# EasyEDA schematic SCH_fpga扩展板v1_2023-12-09.json

## Sheets
1 Sheet_in: TITLE: Sheet_1; REV: 1.0; Date: 2023-11-29; Sheet: 1/1; Company: Your Company
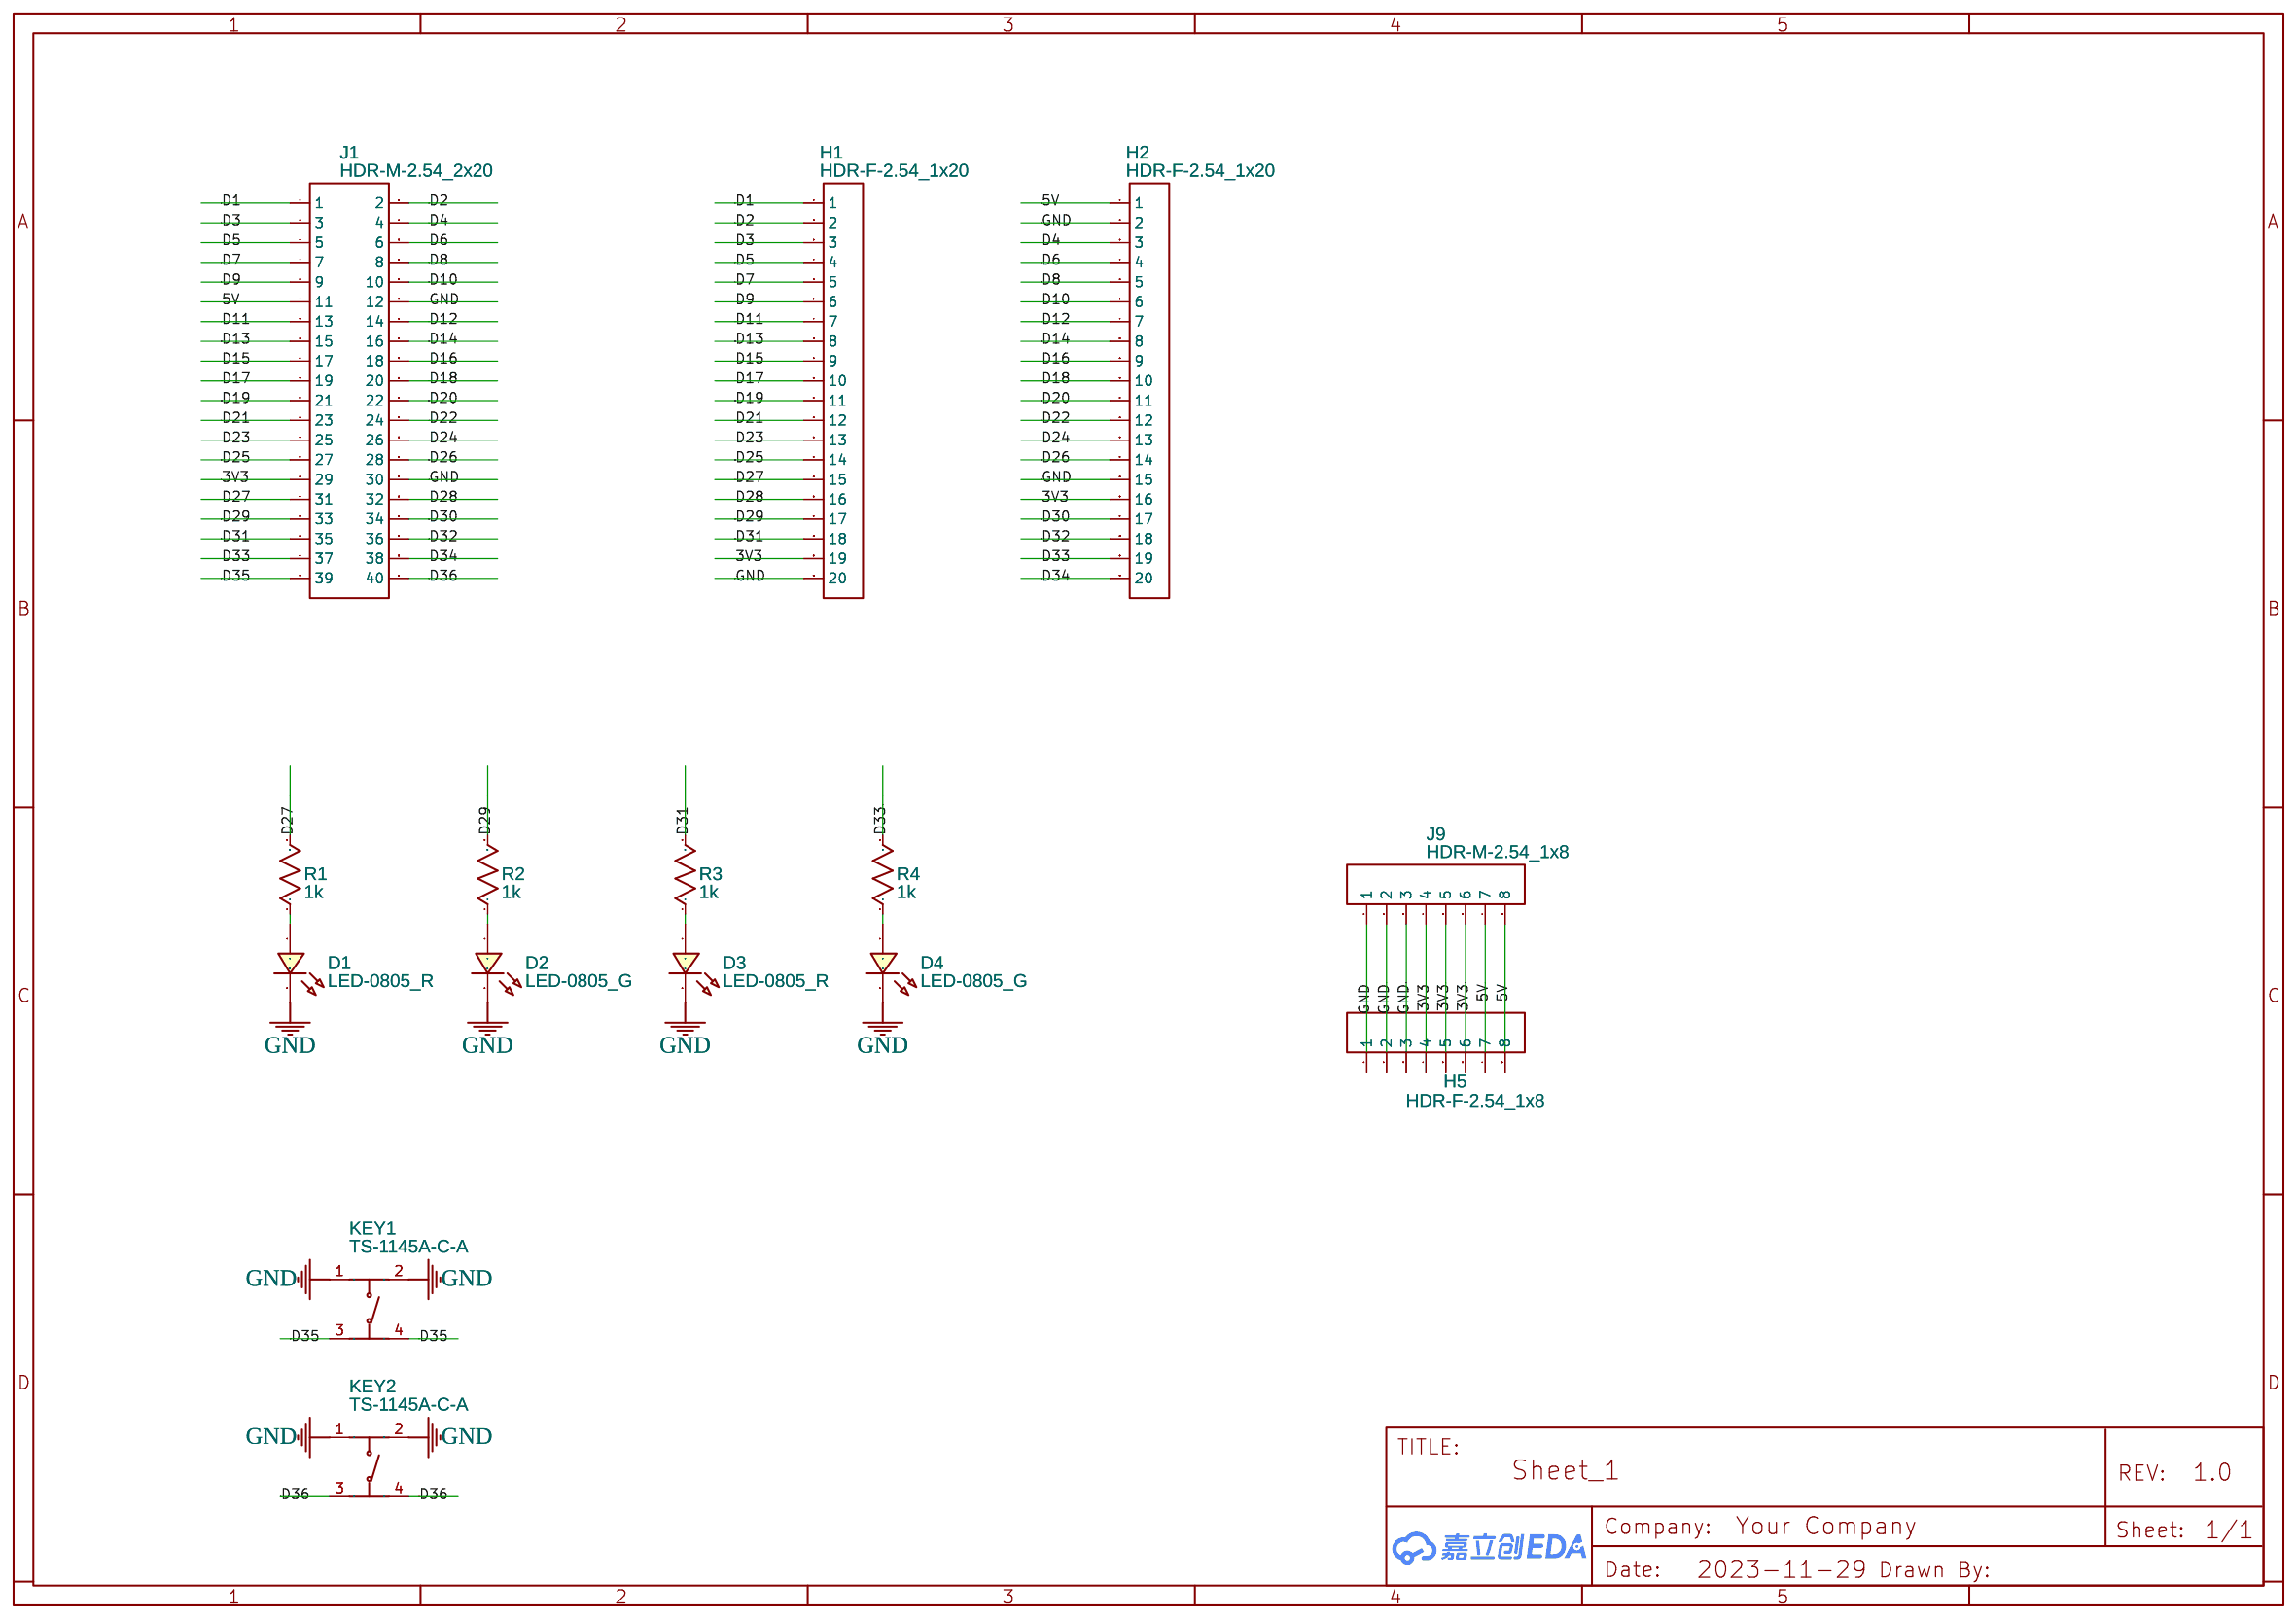
[diagram p0: Sheet_in]
2 Sheet_ctrl: TITLE: Sheet_2
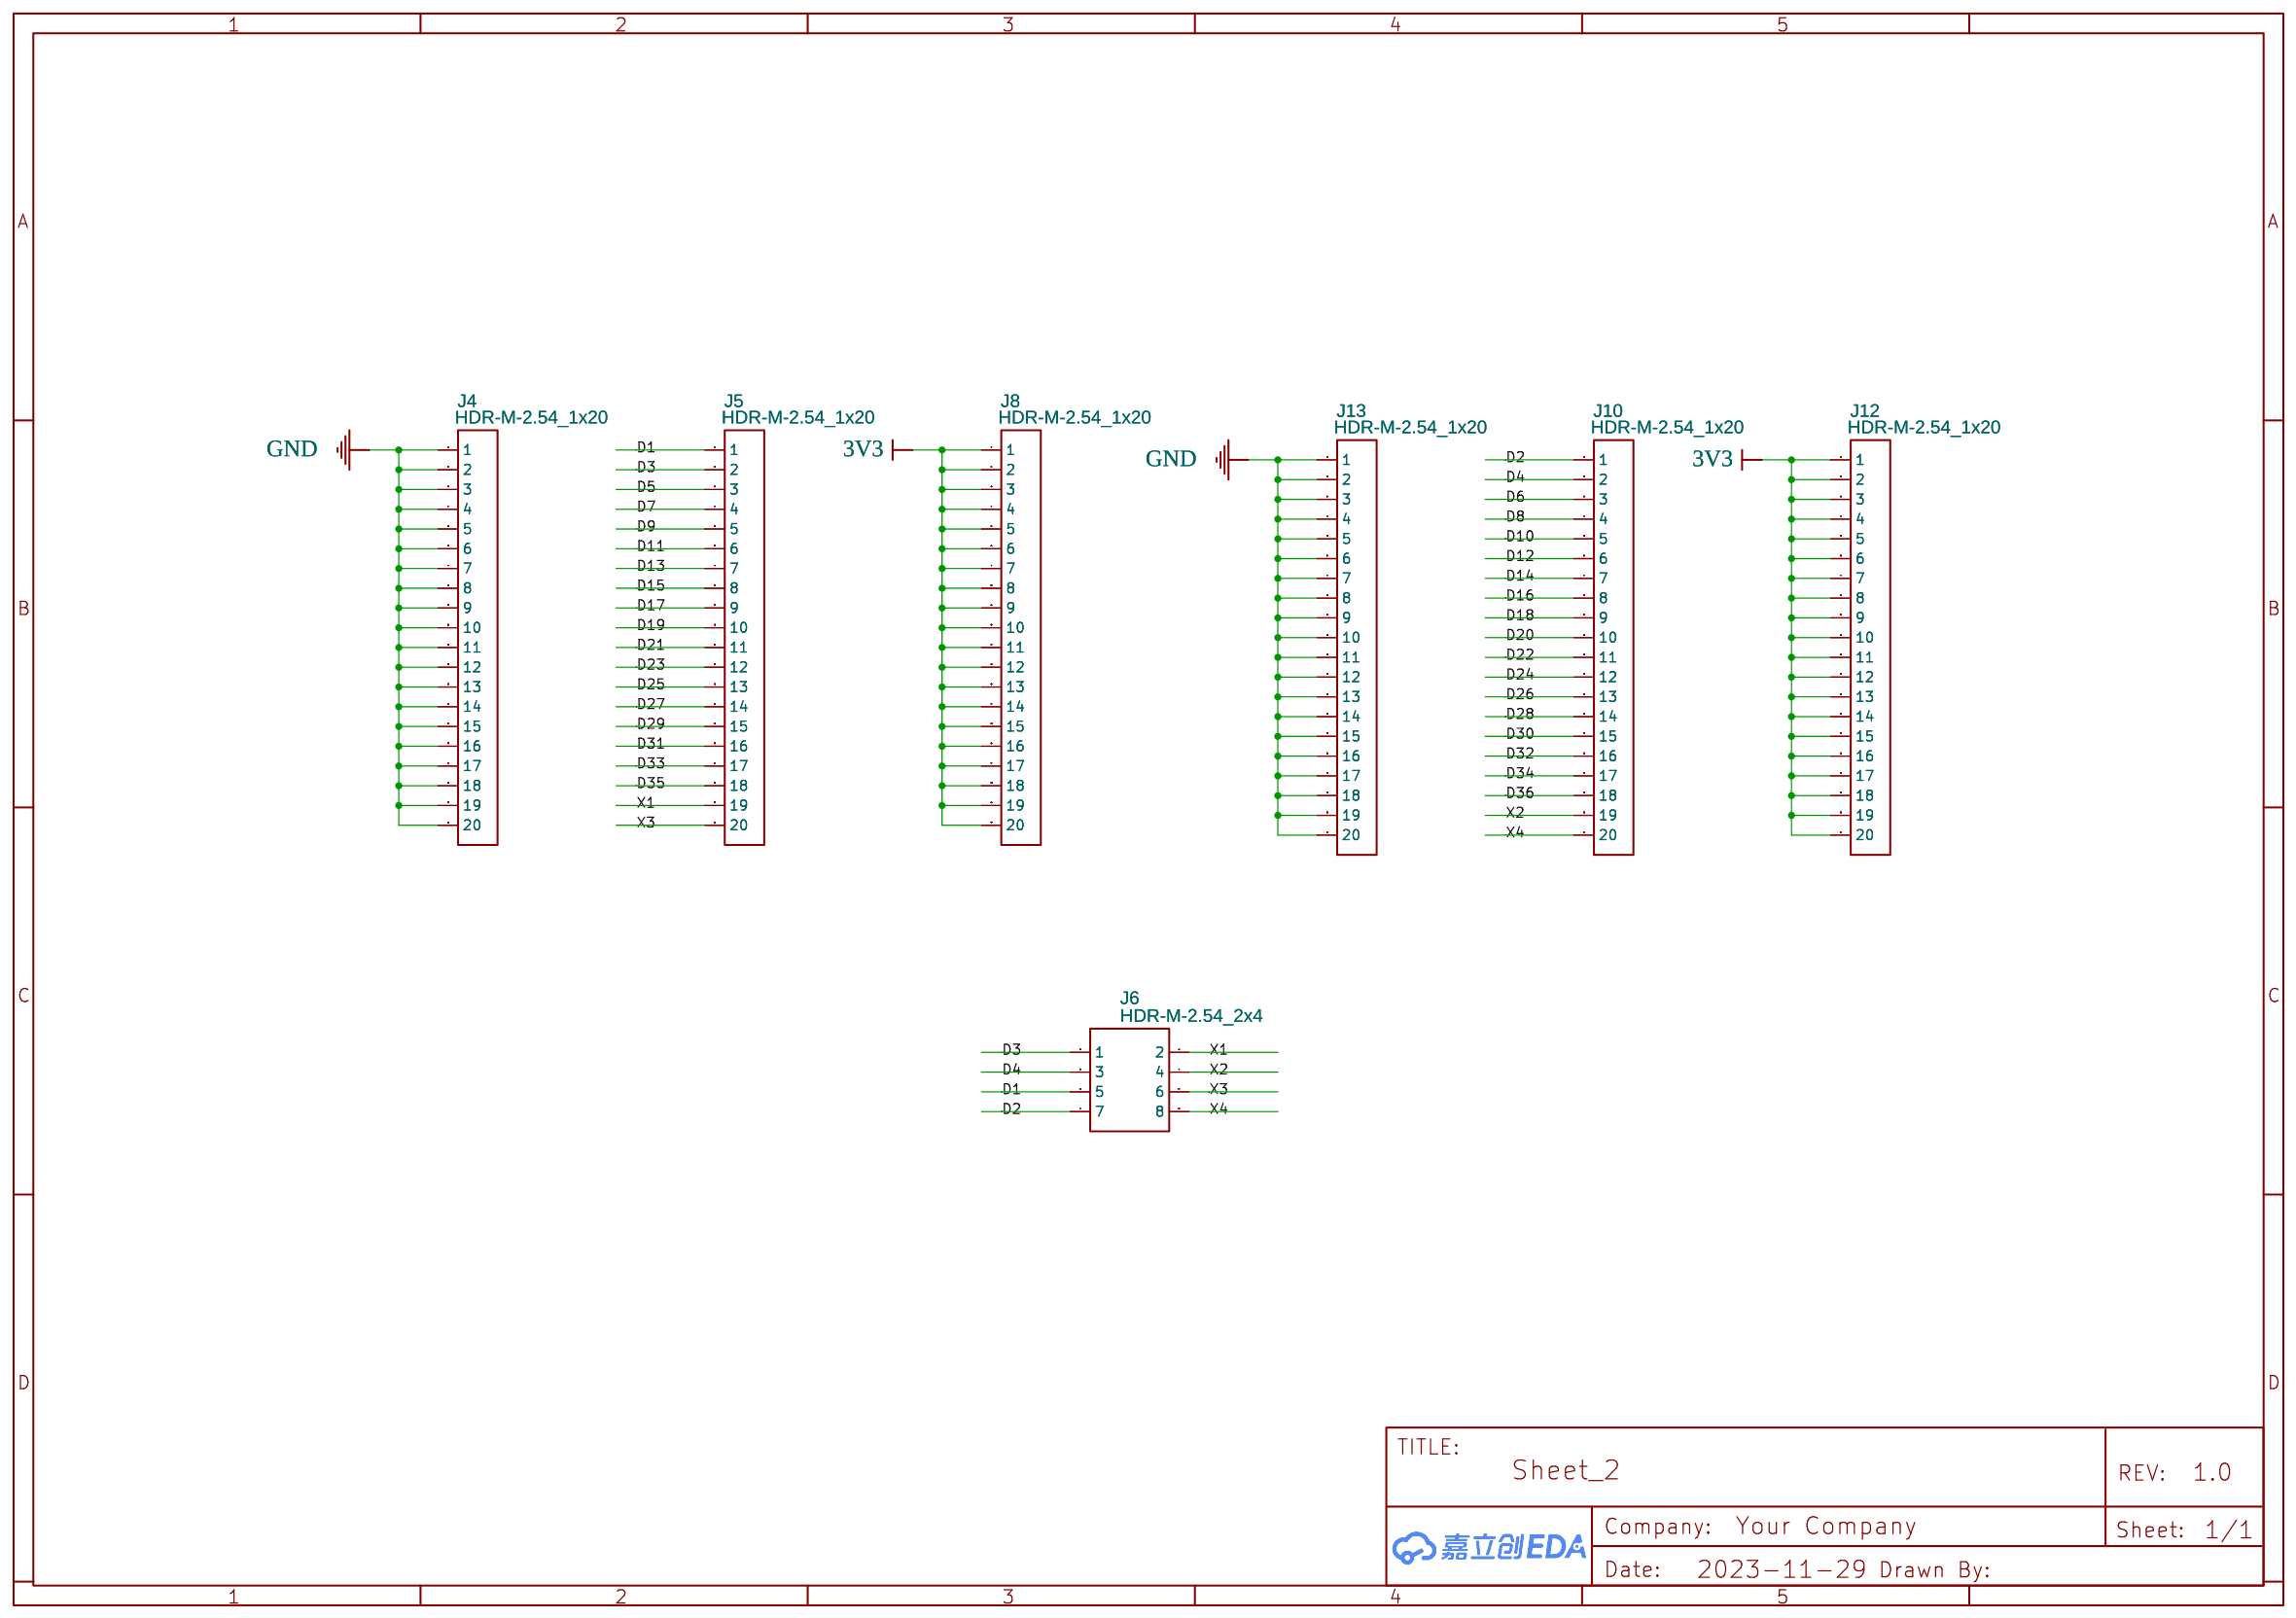
[diagram p1: Sheet_ctrl]
3 Sheet_out
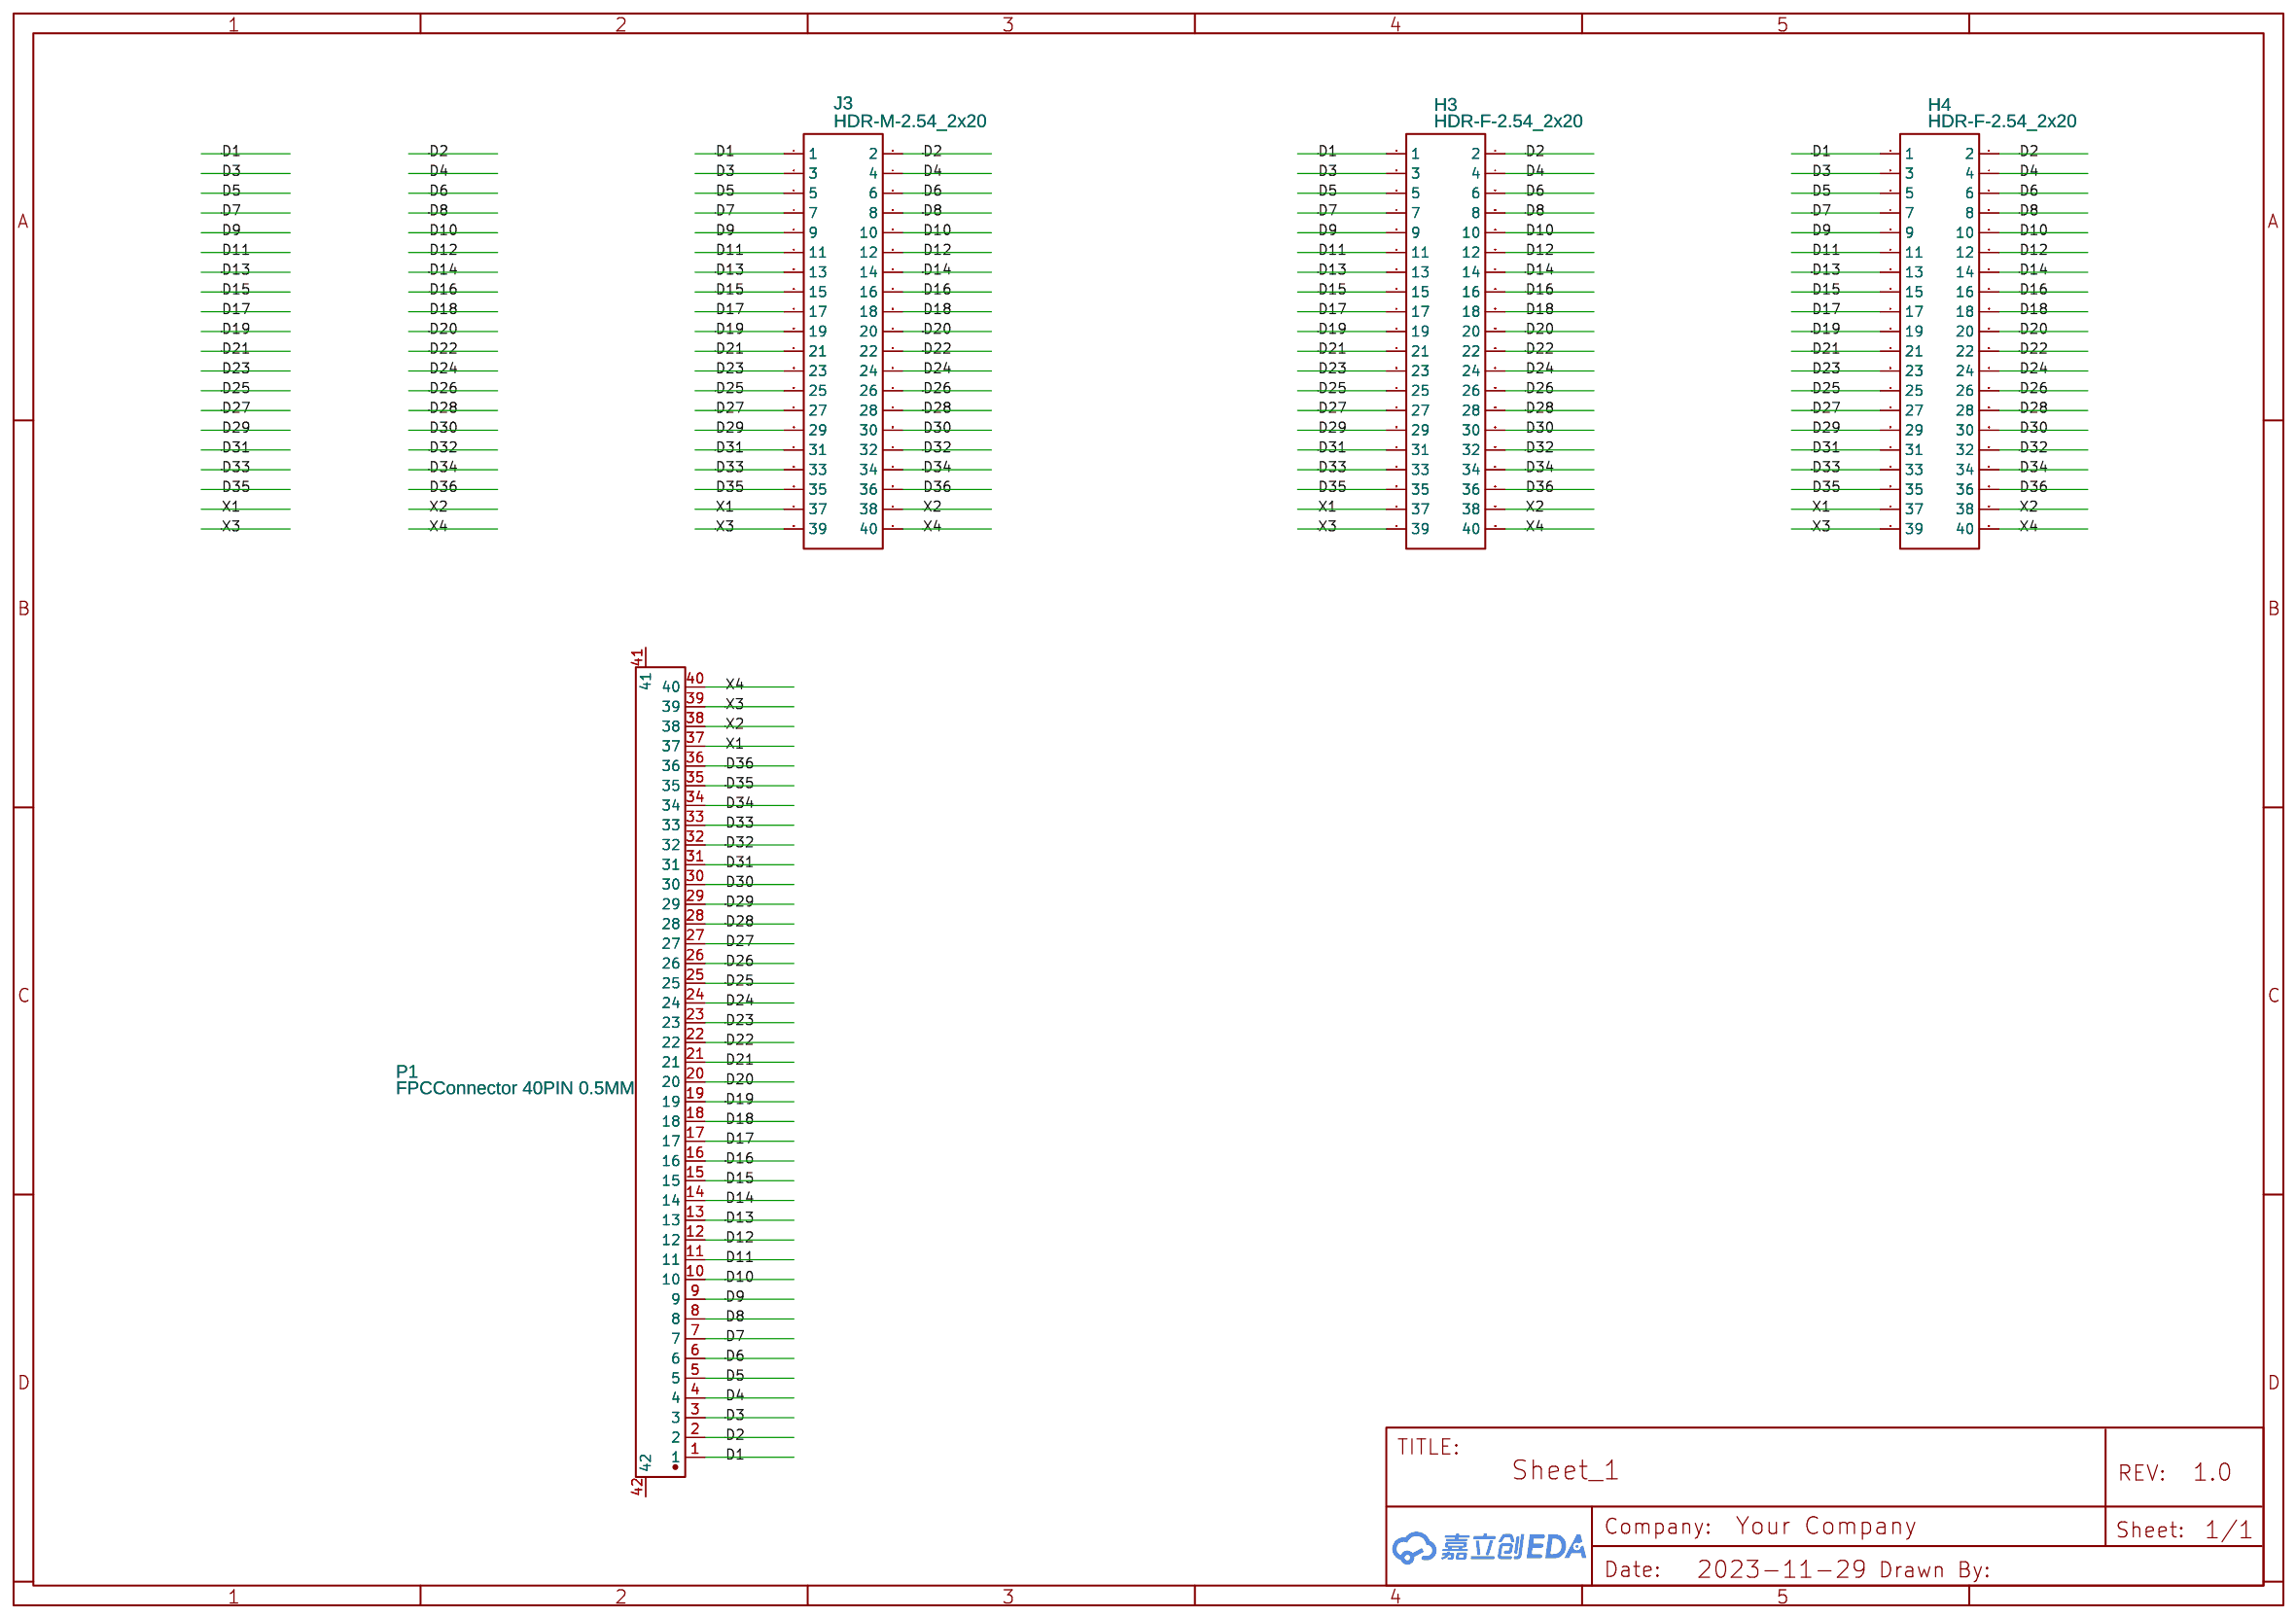
[diagram p2: Sheet_out]

## Parts
sheet Sheet_ctrl
J4  HDR-M-2.54_1x20  [HDR-M-2.54_1X20]
J5  HDR-M-2.54_1x20  [HDR-M-2.54_1X20]
J6  HDR-M-2.54_2x4  [HDR-M-2.54_2X4]
J8  HDR-M-2.54_1x20  [HDR-M-2.54_1X20]
J10  HDR-M-2.54_1x20  [HDR-M-2.54_1X20]
J12  HDR-M-2.54_1x20  [HDR-M-2.54_1X20]
J13  HDR-M-2.54_1x20  [HDR-M-2.54_1X20]
sheet Sheet_in
D1  LED-0805_R  [LED0805_RED]
D2  LED-0805_G  [LED0805_GREEN]
D3  LED-0805_R  [LED0805_RED]
D4  LED-0805_G  [LED0805_GREEN]
H1  HDR-F-2.54_1x20  [HDR-F-2.54_1X20]
H2  HDR-F-2.54_1x20  [HDR-F-2.54_1X20]
H5  HDR-F-2.54_1x8  [HDR-F-2.54_1X8]
J1  HDR-M-2.54_2x20  [HDR-M-2.54_2X20]
J9  HDR-M-2.54_1x8  [HDR-M-2.54_1X8]
KEY1  TS-1145A-C-A  [SW-SMD_4P-L4.2-W3.2-P2.15-LS4.6]
KEY2  TS-1145A-C-A  [SW-SMD_4P-L4.2-W3.2-P2.15-LS4.6]
R1  1k  [R0805]
R2  1k  [R0805]
R3  1k  [R0805]
R4  1k  [R0805]
sheet Sheet_out
H3  HDR-F-2.54_2x20  [HDR-F-2.54_2X20]
H4  HDR-F-2.54_2x20  [HDR-F-2.54_2X20]
J3  HDR-M-2.54_2x20  [HDR-M-2.54_2X20]
P1  FPCConnector 40PIN 0.5MM  [FPC-SMD_40P-P0.50_FG-H2.0-40P]

## Library data of the parts
J4 J5 J8 J10 J12 J13 = HDR-M-2.54_1x20: Supplier Part: C50981; Supplier: LCSC; Contributor: LCEDA_Lib
J6 = HDR-M-2.54_2x4: Supplier Part: C58363; Supplier: LCSC; Contributor: LCEDA_Lib
D1 D3 = LED-0805_R: Manufacturer: EVERLIGHT(台湾亿光); Manufacturer Part: 17-21SURC/S530-A3/TR8; Supplier Part: C72037; Contributor: LCEDA_Lib
D2 D4 = LED-0805_G: Manufacturer: 国星光电; Manufacturer Part: NCD0805G1; Supplier Part: C84260; Contributor: LCEDA_Lib
H1 H2 = HDR-F-2.54_1x20: Supplier Part: C50984; Supplier: LCSC; Contributor: LCEDA_Lib
H5 = HDR-F-2.54_1x8: Supplier Part: C225505; Supplier: LCSC; Contributor: LCEDA_Lib
J1 J3 = HDR-M-2.54_2x20: Supplier Part: C50980; Supplier: LCSC; Contributor: LCEDA_Lib
J9 = HDR-M-2.54_1x8: Supplier Part: C190820; Supplier: LCSC; Contributor: LCEDA_Lib
KEY1 KEY2 = TS-1145A-C-A: Supplier: LCSC; Supplier Part: C318903; Manufacturer: XKB Enterprise; Contributor: LCSC; JLCPCB Part Class: Extended Part
R1-R4 = R_0805_US: Supplier Part: C75781; Supplier: LCSC; Contributor: LCEDA_Lib; Manufacturer Part: TC0525F1001T5E; Manufacturer: UniOhm
H3 H4 = HDR-F-2.54_2x20: Supplier Part: C50982; Supplier: LCSC; Contributor: LCEDA_Lib
P1 = FPCConnector 40PIN 0.5MM: Supplier: LCSC; Manufacturer: BOOMELE(博穆精密); Manufacturer Part: 0.5-40P翻盖; Supplier Part: C9160; JLCPCB Part Class: Extended Part

## Nets
3V3: H1.19 H2.16 H5.4 H5.5 H5.6 J1.29 J8.1 J8.2 J8.3 J8.4 J8.5 J8.6 J8.7 J8.8 J8.9 J8.10 J8.11 J8.12 J8.13 J8.14 J8.15 J8.16 J8.17 J8.18 J8.19 J8.20 J9.4 J9.5 J9.6 J12.1 J12.2 J12.3 J12.4 J12.5 J12.6 J12.7 J12.8 J12.9 J12.10 J12.11 J12.12 J12.13 J12.14 J12.15 J12.16 J12.17 J12.18 J12.19 J12.20
5V: H2.1 H5.7 H5.8 J1.11 J9.7 J9.8
GND: D1.2 D2.2 D3.2 D4.2 H1.20 H2.2 H2.15 H5.1 H5.2 H5.3 J1.12 J1.30 J4.1 J4.2 J4.3 J4.4 J4.5 J4.6 J4.7 J4.8 J4.9 J4.10 J4.11 J4.12 J4.13 J4.14 J4.15 J4.16 J4.17 J4.18 J4.19 J4.20 J9.1 J9.2 J9.3 J13.1 J13.2 J13.3 J13.4 J13.5 J13.6 J13.7 J13.8 J13.9 J13.10 J13.11 J13.12 J13.13 J13.14 J13.15 J13.16 J13.17 J13.18 J13.19 J13.20 KEY1.1 KEY1.2 KEY2.1 KEY2.2
D1: H1.1 H3.1 H4.1 J1.1 J3.1 J5.1 J6.5 P1.1
D2: H1.2 H3.2 H4.2 J1.2 J3.2 J6.7 J10.1 P1.2
D3: H1.3 H3.3 H4.3 J1.3 J3.3 J5.2 J6.1 P1.3
D4: H2.3 H3.4 H4.4 J1.4 J3.4 J6.3 J10.2 P1.4
D5: H1.4 H3.5 H4.5 J1.5 J3.5 J5.3 P1.5
D6: H2.4 H3.6 H4.6 J1.6 J3.6 J10.3 P1.6
D7: H1.5 H3.7 H4.7 J1.7 J3.7 J5.4 P1.7
D8: H2.5 H3.8 H4.8 J1.8 J3.8 J10.4 P1.8
D9: H1.6 H3.9 H4.9 J1.9 J3.9 J5.5 P1.9
D10: H2.6 H3.10 H4.10 J1.10 J3.10 J10.5 P1.10
D11: H1.7 H3.11 H4.11 J1.13 J3.11 J5.6 P1.11
D12: H2.7 H3.12 H4.12 J1.14 J3.12 J10.6 P1.12
D13: H1.8 H3.13 H4.13 J1.15 J3.13 J5.7 P1.13
D14: H2.8 H3.14 H4.14 J1.16 J3.14 J10.7 P1.14
D15: H1.9 H3.15 H4.15 J1.17 J3.15 J5.8 P1.15
D16: H2.9 H3.16 H4.16 J1.18 J3.16 J10.8 P1.16
D17: H1.10 H3.17 H4.17 J1.19 J3.17 J5.9 P1.17
D18: H2.10 H3.18 H4.18 J1.20 J3.18 J10.9 P1.18
D19: H1.11 H3.19 H4.19 J1.21 J3.19 J5.10 P1.19
D20: H2.11 H3.20 H4.20 J1.22 J3.20 J10.10 P1.20
D21: H1.12 H3.21 H4.21 J1.23 J3.21 J5.11 P1.21
D22: H2.12 H3.22 H4.22 J1.24 J3.22 J10.11 P1.22
D23: H1.13 H3.23 H4.23 J1.25 J3.23 J5.12 P1.23
D24: H2.13 H3.24 H4.24 J1.26 J3.24 J10.12 P1.24
D25: H1.14 H3.25 H4.25 J1.27 J3.25 J5.13 P1.25
D26: H2.14 H3.26 H4.26 J1.28 J3.26 J10.13 P1.26
D27: H1.15 H3.27 H4.27 J1.31 J3.27 J5.14 P1.27 R1.2
D28: H1.16 H3.28 H4.28 J1.32 J3.28 J10.14 P1.28
D29: H1.17 H3.29 H4.29 J1.33 J3.29 J5.15 P1.29 R2.2
D30: H2.17 H3.30 H4.30 J1.34 J3.30 J10.15 P1.30
D31: H1.18 H3.31 H4.31 J1.35 J3.31 J5.16 P1.31 R3.2
D32: H2.18 H3.32 H4.32 J1.36 J3.32 J10.16 P1.32
D33: H2.19 H3.33 H4.33 J1.37 J3.33 J5.17 P1.33 R4.2
D34: H2.20 H3.34 H4.34 J1.38 J3.34 J10.17 P1.34
D35: H3.35 H4.35 J1.39 J3.35 J5.18 KEY1.3 KEY1.4 P1.35
D36: H3.36 H4.36 J1.40 J3.36 J10.18 KEY2.3 KEY2.4 P1.36
X1: H3.37 H4.37 J3.37 J5.19 J6.2 P1.37
X2: H3.38 H4.38 J3.38 J6.4 J10.19 P1.38
X3: H3.39 H4.39 J3.39 J5.20 J6.6 P1.39
X4: H3.40 H4.40 J3.40 J6.8 J10.20 P1.40
Net-(D1-1): D1.1 R1.1
Net-(D2-1): D2.1 R2.1
Net-(D3-1): D3.1 R3.1
Net-(D4-1): D4.1 R4.1

Not connected (* = marked no-connect by the designer): P1 41 42
